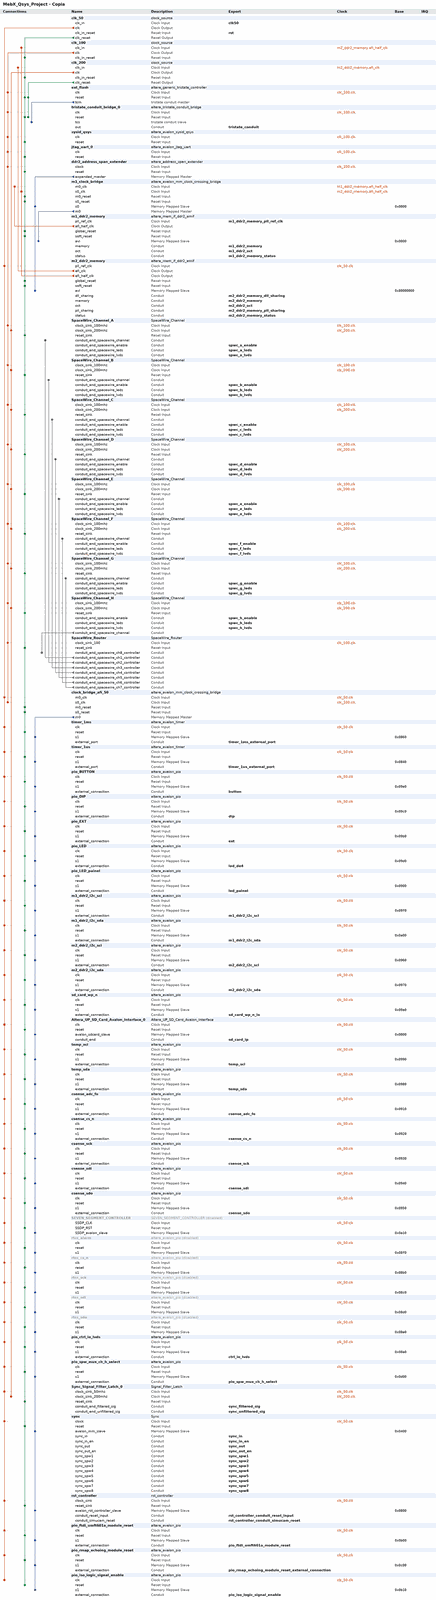
[diagram p0: system contents, whole]
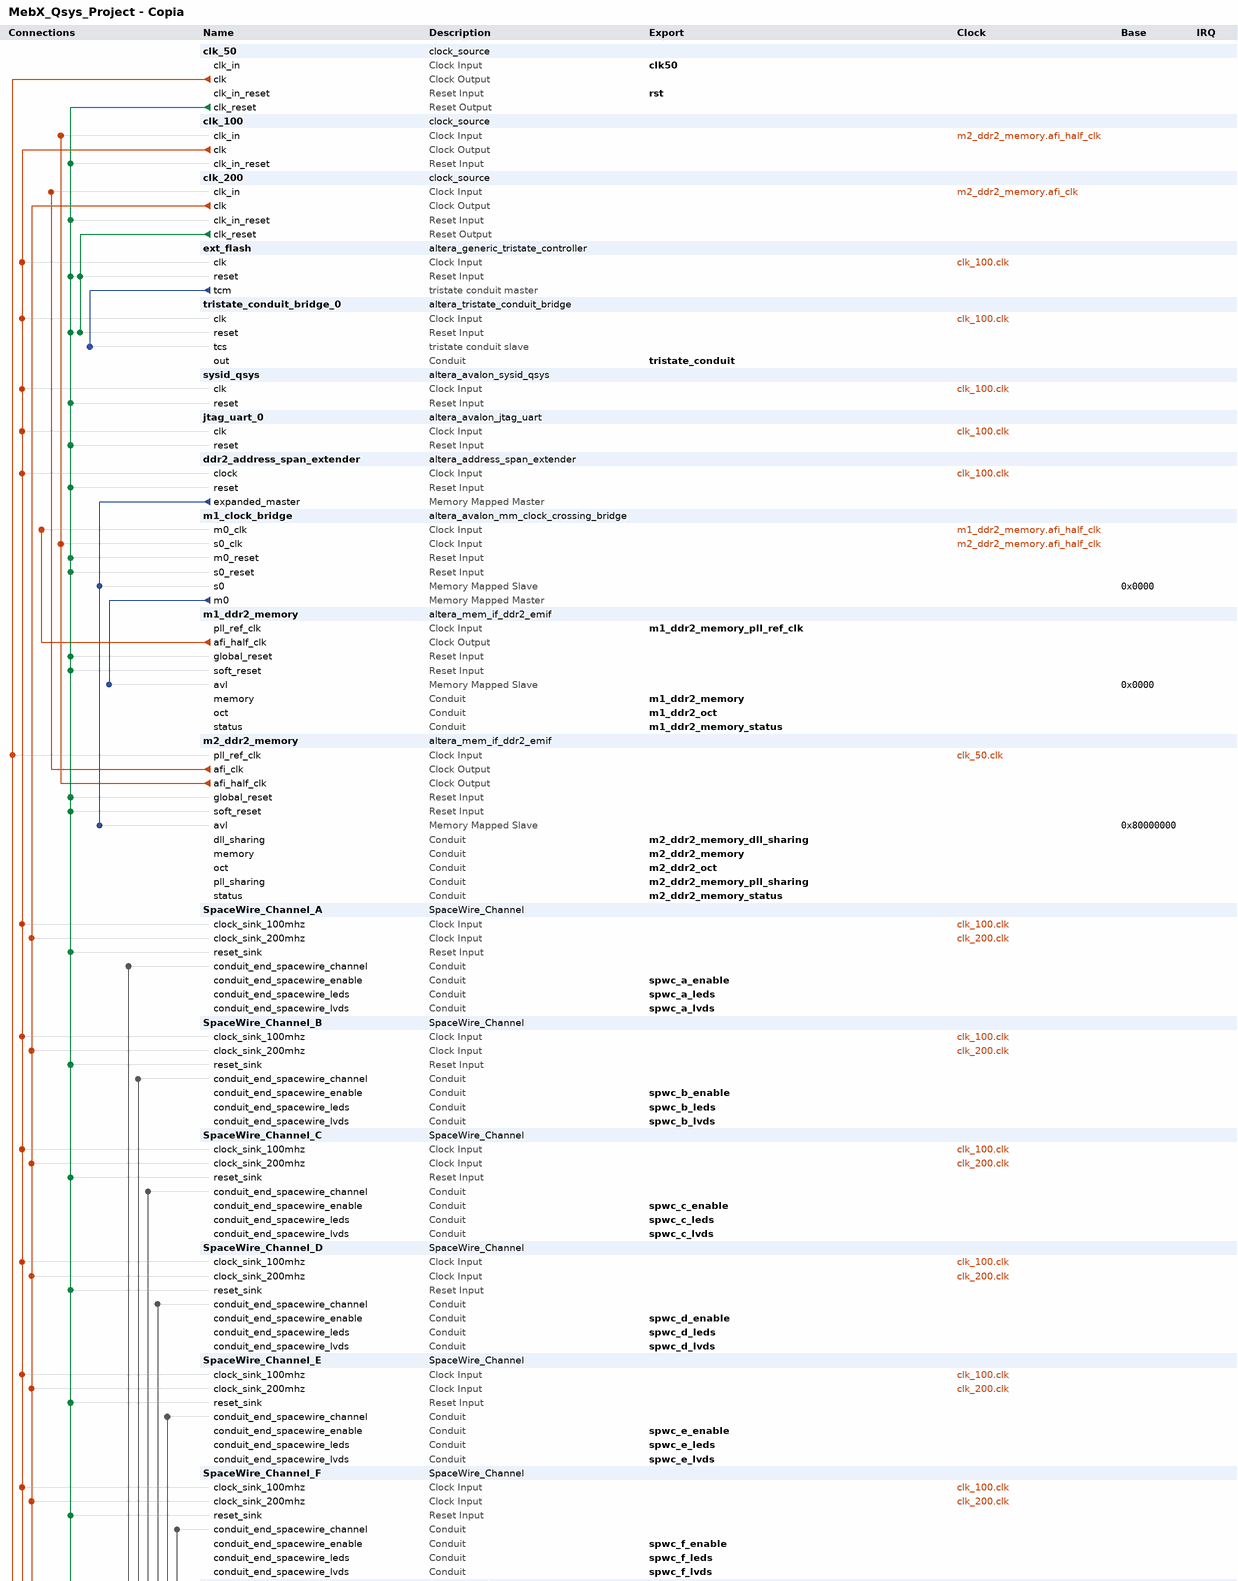
[diagram p1: system contents, upper part]
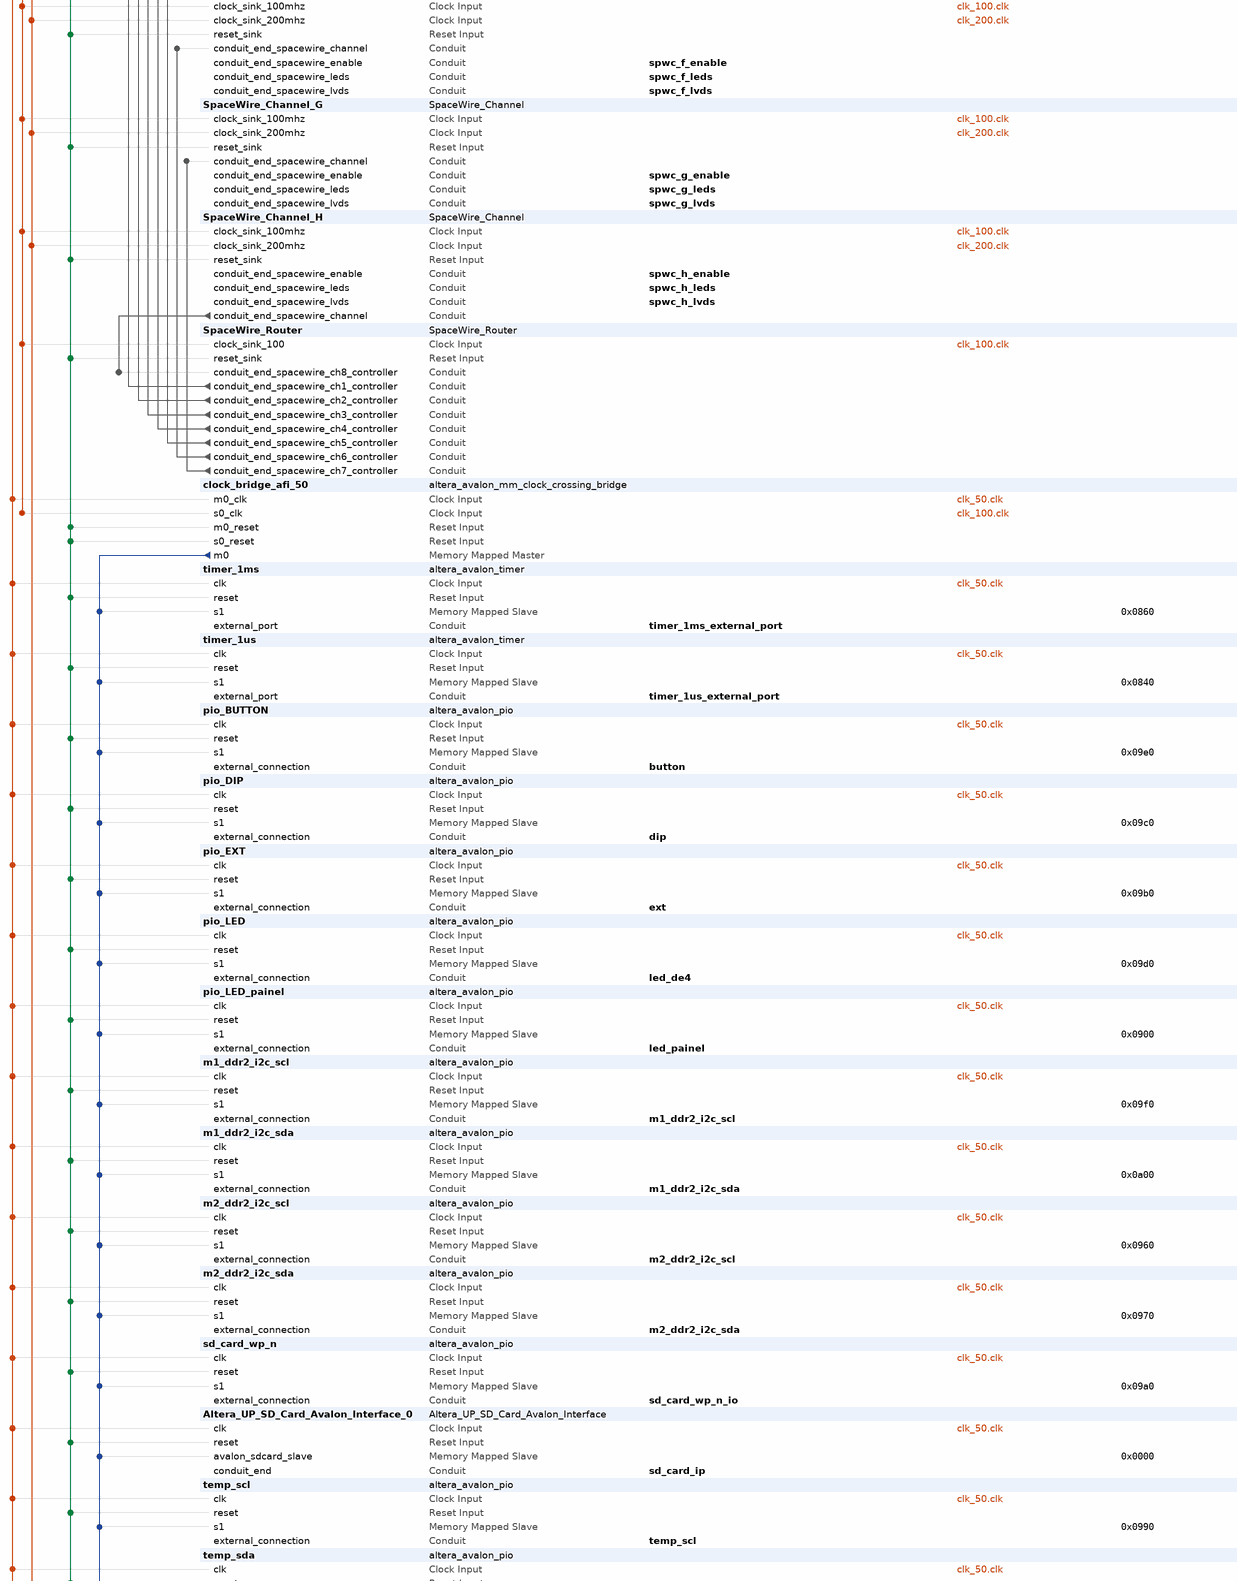
[diagram p2: system contents, middle part]
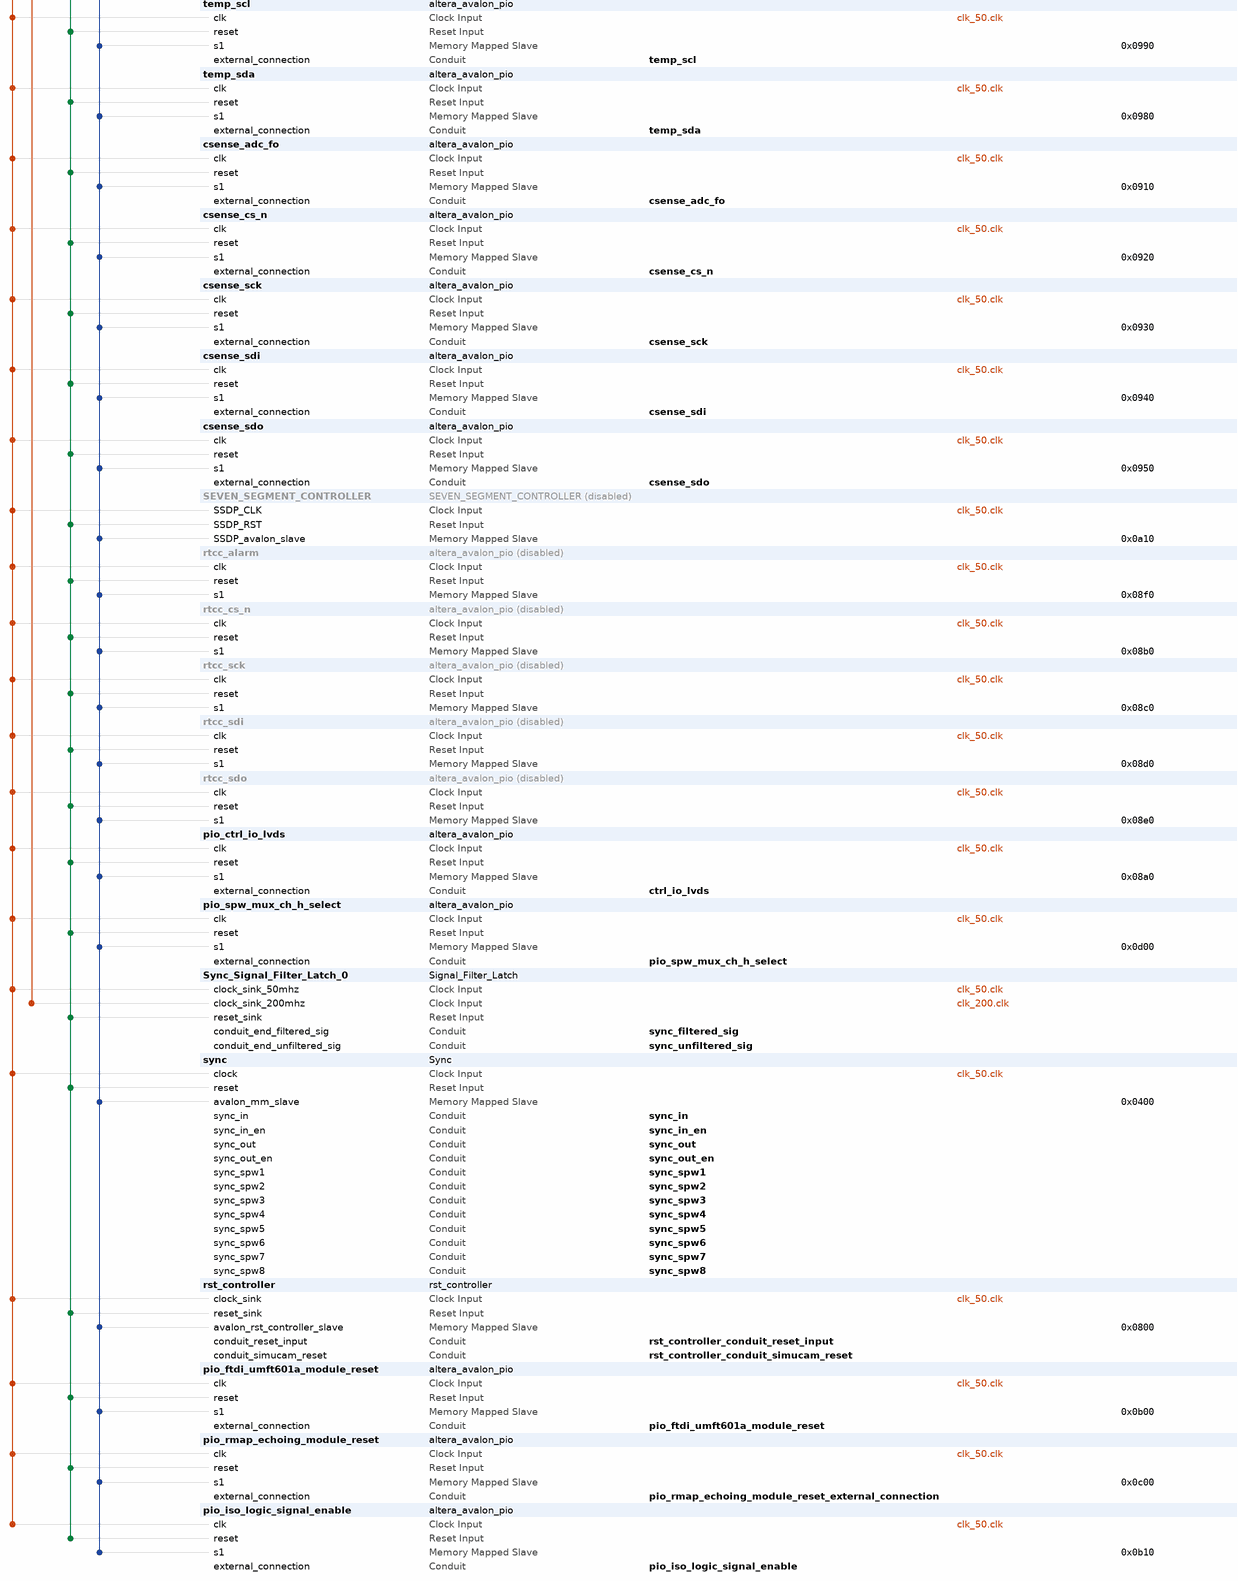
[diagram p3: system contents, lower part]
# Platform Designer (Qsys) system MebX_Qsys_Project - Copia, Stratix IV EP4SGX230KF40C2
# Parameters at their usual value, and those the tool derives, are not listed.
package require -exact qsys 18.1
create_system {MebX_Qsys_Project - Copia}
set_project_property DEVICE_FAMILY {Stratix IV}
set_project_property DEVICE EP4SGX230KF40C2

add_instance clk_50 clock_source 18.1
set_instance_parameter_value clk_50 clockFrequency 50000000

add_instance clk_100 clock_source 18.1
set_instance_parameter_value clk_100 clockFrequency 100000000

add_instance clk_200 clock_source 18.1
set_instance_parameter_value clk_200 clockFrequency 200000000

add_instance ext_flash altera_generic_tristate_controller 18.1
set_instance_parameter_value ext_flash ACTIVE_LOW_BEGINTRANSFER 0
set_instance_parameter_value ext_flash ACTIVE_LOW_BYTEENABLE 0
set_instance_parameter_value ext_flash ACTIVE_LOW_OUTPUTENABLE 0
set_instance_parameter_value ext_flash ACTIVE_LOW_READ 1
set_instance_parameter_value ext_flash CHIPSELECT_THROUGH_READLATENCY 0
set_instance_parameter_value ext_flash INTERFACE_ASSIGNMENT_KEYS embeddedsw.configuration.isFlash,embeddedsw.configuration.isNonVolatileStorage,embeddedsw.configuration.isMemoryDevice
set_instance_parameter_value ext_flash INTERFACE_ASSIGNMENT_VALUES 1,1,1
set_instance_parameter_value ext_flash MODULE_ASSIGNMENT_KEYS embeddedsw.configuration.hwClassnameDriverSupportList,embeddedsw.configuration.hwClassnameDriverSupportDefault,embeddedsw.CMacro.SETUP_VALUE,embeddedsw.CMacro.WAIT_VALUE,embeddedsw.CMacro.HOLD_VALUE,embeddedsw.CMacro.TIMING_UNITS,embeddedsw.CMacro.SIZE,embeddedsw.memoryInfo.MEM_INIT_DATA_WIDTH,embeddedsw.memoryInfo.HAS_BYTE_LANE,embeddedsw.memoryInfo.IS_FLASH,embeddedsw.memoryInfo.GENERATE_DAT_SYM,embeddedsw.memoryInfo.GENERATE_FLASH,embeddedsw.memoryInfo.DAT_SYM_INSTALL_DIR,embeddedsw.memoryInfo.FLASH_INSTALL_DIR
set_instance_parameter_value ext_flash MODULE_ASSIGNMENT_VALUES "altera_avalon_lan91c111\\,altera_avalon_cfi_flash,altera_avalon_cfi_flash,25,100,20,\"ns\",33554432u,16,1,1,1,1,SIM_DIR,APP_DIR"
set_instance_parameter_value ext_flash TCM_ADDRESS_W 26
set_instance_parameter_value ext_flash TCM_BYTEENABLE_W 2
set_instance_parameter_value ext_flash TCM_DATA_HOLD 20
set_instance_parameter_value ext_flash TCM_DATA_W 16
set_instance_parameter_value ext_flash TCM_MAX_PENDING_READ_TRANSACTIONS 3
set_instance_parameter_value ext_flash TCM_READLATENCY 2
set_instance_parameter_value ext_flash TCM_READ_WAIT 100
set_instance_parameter_value ext_flash TCM_SETUP_WAIT 25
set_instance_parameter_value ext_flash TCM_SYMBOLS_PER_WORD 2
set_instance_parameter_value ext_flash TCM_TIMING_UNITS 0
set_instance_parameter_value ext_flash TCM_TURNAROUND_TIME 2
set_instance_parameter_value ext_flash TCM_WRITE_WAIT 100
set_instance_parameter_value ext_flash USE_BEGINTRANSFER 0
set_instance_parameter_value ext_flash USE_BYTEENABLE 0
set_instance_parameter_value ext_flash USE_OUTPUTENABLE 0
set_instance_parameter_value ext_flash USE_READ 1

add_instance tristate_conduit_bridge_0 altera_tristate_conduit_bridge 18.1

add_instance sysid_qsys altera_avalon_sysid_qsys 18.1
set_instance_parameter_value sysid_qsys id 113

add_instance jtag_uart_0 altera_avalon_jtag_uart 18.1
set_instance_parameter_value jtag_uart_0 simInteractiveOptions NO_INTERACTIVE_WINDOWS

add_instance ddr2_address_span_extender altera_address_span_extender 18.1
set_instance_parameter_value ddr2_address_span_extender BURSTCOUNT_WIDTH 8
set_instance_parameter_value ddr2_address_span_extender DATA_WIDTH 32
set_instance_parameter_value ddr2_address_span_extender ENABLE_SLAVE_PORT true
set_instance_parameter_value ddr2_address_span_extender MASTER_ADDRESS_DEF 0
set_instance_parameter_value ddr2_address_span_extender MAX_PENDING_READS 8
set_instance_parameter_value ddr2_address_span_extender SLAVE_ADDRESS_WIDTH 29

add_instance m1_clock_bridge altera_avalon_mm_clock_crossing_bridge 18.1
set_instance_parameter_value m1_clock_bridge ADDRESS_WIDTH 31
set_instance_parameter_value m1_clock_bridge COMMAND_FIFO_DEPTH 2
set_instance_parameter_value m1_clock_bridge DATA_WIDTH 256
set_instance_parameter_value m1_clock_bridge MASTER_SYNC_DEPTH 2
set_instance_parameter_value m1_clock_bridge MAX_BURST_SIZE 1
set_instance_parameter_value m1_clock_bridge RESPONSE_FIFO_DEPTH 2
set_instance_parameter_value m1_clock_bridge SLAVE_SYNC_DEPTH 2
set_instance_parameter_value m1_clock_bridge USE_AUTO_ADDRESS_WIDTH 1

add_instance m1_ddr2_memory altera_mem_if_ddr2_emif 18.1
set_instance_parameter_value m1_ddr2_memory AVL_MAX_SIZE 1
set_instance_parameter_value m1_ddr2_memory CALIBRATION_MODE Full
set_instance_parameter_value m1_ddr2_memory DLL_SHARING_MODE None
set_instance_parameter_value m1_ddr2_memory EXPORT_AFI_HALF_CLK true
set_instance_parameter_value m1_ddr2_memory MEM_BANKADDR_WIDTH 3
set_instance_parameter_value m1_ddr2_memory MEM_CLK_FREQ 400.0
set_instance_parameter_value m1_ddr2_memory MEM_COL_ADDR_WIDTH 10
set_instance_parameter_value m1_ddr2_memory MEM_DQ_WIDTH 64
set_instance_parameter_value m1_ddr2_memory MEM_NUMBER_OF_RANKS_PER_DIMM 2
set_instance_parameter_value m1_ddr2_memory MEM_ROW_ADDR_WIDTH 14
set_instance_parameter_value m1_ddr2_memory MEM_TCL 6
set_instance_parameter_value m1_ddr2_memory MEM_TRAS_NS 45.0
set_instance_parameter_value m1_ddr2_memory PLL_SHARING_MODE None
set_instance_parameter_value m1_ddr2_memory POWER_OF_TWO_BUS true
set_instance_parameter_value m1_ddr2_memory REF_CLK_FREQ 50.0
set_instance_parameter_value m1_ddr2_memory TIMING_TDQSQ 240
set_instance_parameter_value m1_ddr2_memory TIMING_TIH 375
set_instance_parameter_value m1_ddr2_memory TIMING_TQHS 340
set_instance_parameter_value m1_ddr2_memory USER_DEBUG_LEVEL 0

add_instance m2_ddr2_memory altera_mem_if_ddr2_emif 18.1
set_instance_parameter_value m2_ddr2_memory AVL_MAX_SIZE 1
set_instance_parameter_value m2_ddr2_memory CALIBRATION_MODE Full
set_instance_parameter_value m2_ddr2_memory DLL_SHARING_MODE Master
set_instance_parameter_value m2_ddr2_memory EXPORT_AFI_HALF_CLK true
set_instance_parameter_value m2_ddr2_memory MEM_BANKADDR_WIDTH 3
set_instance_parameter_value m2_ddr2_memory MEM_CLK_FREQ 400.0
set_instance_parameter_value m2_ddr2_memory MEM_COL_ADDR_WIDTH 10
set_instance_parameter_value m2_ddr2_memory MEM_DQ_WIDTH 64
set_instance_parameter_value m2_ddr2_memory MEM_NUMBER_OF_RANKS_PER_DIMM 2
set_instance_parameter_value m2_ddr2_memory MEM_ROW_ADDR_WIDTH 14
set_instance_parameter_value m2_ddr2_memory MEM_TCL 6
set_instance_parameter_value m2_ddr2_memory MEM_TRAS_NS 45.0
set_instance_parameter_value m2_ddr2_memory PLL_SHARING_MODE Master
set_instance_parameter_value m2_ddr2_memory POWER_OF_TWO_BUS true
set_instance_parameter_value m2_ddr2_memory REF_CLK_FREQ 50.0
set_instance_parameter_value m2_ddr2_memory TIMING_TDQSQ 240
set_instance_parameter_value m2_ddr2_memory TIMING_TIH 375
set_instance_parameter_value m2_ddr2_memory TIMING_TQHS 340
set_instance_parameter_value m2_ddr2_memory USER_DEBUG_LEVEL 0

add_instance SpaceWire_Channel_A SpaceWire_Channel 1.5

add_instance SpaceWire_Channel_B SpaceWire_Channel 1.5

add_instance SpaceWire_Channel_C SpaceWire_Channel 1.5

add_instance SpaceWire_Channel_D SpaceWire_Channel 1.5

add_instance SpaceWire_Channel_E SpaceWire_Channel 1.5

add_instance SpaceWire_Channel_F SpaceWire_Channel 1.5

add_instance SpaceWire_Channel_G SpaceWire_Channel 1.5

add_instance SpaceWire_Channel_H SpaceWire_Channel 1.5

add_instance SpaceWire_Router SpaceWire_Router 1.0

add_instance clock_bridge_afi_50 altera_avalon_mm_clock_crossing_bridge 18.1
set_instance_parameter_value clock_bridge_afi_50 ADDRESS_WIDTH 32
set_instance_parameter_value clock_bridge_afi_50 COMMAND_FIFO_DEPTH 4
set_instance_parameter_value clock_bridge_afi_50 DATA_WIDTH 32
set_instance_parameter_value clock_bridge_afi_50 MASTER_SYNC_DEPTH 2
set_instance_parameter_value clock_bridge_afi_50 MAX_BURST_SIZE 1
set_instance_parameter_value clock_bridge_afi_50 RESPONSE_FIFO_DEPTH 4
set_instance_parameter_value clock_bridge_afi_50 SLAVE_SYNC_DEPTH 2
set_instance_parameter_value clock_bridge_afi_50 USE_AUTO_ADDRESS_WIDTH 1

add_instance timer_1ms altera_avalon_timer 18.1
set_instance_parameter_value timer_1ms alwaysRun true
set_instance_parameter_value timer_1ms period 1
set_instance_parameter_value timer_1ms periodUnits MSEC
set_instance_parameter_value timer_1ms timeoutPulseOutput true

add_instance timer_1us altera_avalon_timer 18.1
set_instance_parameter_value timer_1us alwaysRun true
set_instance_parameter_value timer_1us period 1
set_instance_parameter_value timer_1us periodUnits USEC
set_instance_parameter_value timer_1us timeoutPulseOutput true

add_instance pio_BUTTON altera_avalon_pio 18.1
set_instance_parameter_value pio_BUTTON direction Input
set_instance_parameter_value pio_BUTTON width 4

add_instance pio_DIP altera_avalon_pio 18.1
set_instance_parameter_value pio_DIP direction Input
set_instance_parameter_value pio_DIP width 8

add_instance pio_EXT altera_avalon_pio 18.1
set_instance_parameter_value pio_EXT bitClearingEdgeCapReg true
set_instance_parameter_value pio_EXT direction Input
set_instance_parameter_value pio_EXT width 1

add_instance pio_LED altera_avalon_pio 18.1
set_instance_parameter_value pio_LED direction Output
set_instance_parameter_value pio_LED width 8

add_instance pio_LED_painel altera_avalon_pio 18.1
set_instance_parameter_value pio_LED_painel direction Output
set_instance_parameter_value pio_LED_painel resetValue 65536
set_instance_parameter_value pio_LED_painel width 21

add_instance m1_ddr2_i2c_scl altera_avalon_pio 18.1
set_instance_parameter_value m1_ddr2_i2c_scl direction Output
set_instance_parameter_value m1_ddr2_i2c_scl width 1

add_instance m1_ddr2_i2c_sda altera_avalon_pio 18.1
set_instance_parameter_value m1_ddr2_i2c_sda direction Bidir
set_instance_parameter_value m1_ddr2_i2c_sda width 1

add_instance m2_ddr2_i2c_scl altera_avalon_pio 18.1
set_instance_parameter_value m2_ddr2_i2c_scl direction Output
set_instance_parameter_value m2_ddr2_i2c_scl width 1

add_instance m2_ddr2_i2c_sda altera_avalon_pio 18.1
set_instance_parameter_value m2_ddr2_i2c_sda direction Bidir
set_instance_parameter_value m2_ddr2_i2c_sda width 1

add_instance sd_card_wp_n altera_avalon_pio 18.1
set_instance_parameter_value sd_card_wp_n direction Input
set_instance_parameter_value sd_card_wp_n width 1

add_instance Altera_UP_SD_Card_Avalon_Interface_0 Altera_UP_SD_Card_Avalon_Interface 18.0

add_instance temp_scl altera_avalon_pio 18.1
set_instance_parameter_value temp_scl direction Output
set_instance_parameter_value temp_scl width 1

add_instance temp_sda altera_avalon_pio 18.1
set_instance_parameter_value temp_sda direction Bidir
set_instance_parameter_value temp_sda width 1

add_instance csense_adc_fo altera_avalon_pio 18.1
set_instance_parameter_value csense_adc_fo direction Output
set_instance_parameter_value csense_adc_fo width 1

add_instance csense_cs_n altera_avalon_pio 18.1
set_instance_parameter_value csense_cs_n direction Output
set_instance_parameter_value csense_cs_n width 2

add_instance csense_sck altera_avalon_pio 18.1
set_instance_parameter_value csense_sck direction Output
set_instance_parameter_value csense_sck width 1

add_instance csense_sdi altera_avalon_pio 18.1
set_instance_parameter_value csense_sdi direction Output
set_instance_parameter_value csense_sdi width 1

add_instance csense_sdo altera_avalon_pio 18.1
set_instance_parameter_value csense_sdo direction Input
set_instance_parameter_value csense_sdo width 1

add_instance SEVEN_SEGMENT_CONTROLLER SEVEN_SEGMENT_CONTROLLER 1.0
set_instance_property SEVEN_SEGMENT_CONTROLLER ENABLED false

add_instance rtcc_alarm altera_avalon_pio 18.1
set_instance_property rtcc_alarm ENABLED false
set_instance_parameter_value rtcc_alarm direction Input
set_instance_parameter_value rtcc_alarm width 1

add_instance rtcc_cs_n altera_avalon_pio 18.1
set_instance_property rtcc_cs_n ENABLED false
set_instance_parameter_value rtcc_cs_n direction Output
set_instance_parameter_value rtcc_cs_n width 1

add_instance rtcc_sck altera_avalon_pio 18.1
set_instance_property rtcc_sck ENABLED false
set_instance_parameter_value rtcc_sck direction Output
set_instance_parameter_value rtcc_sck width 1

add_instance rtcc_sdi altera_avalon_pio 18.1
set_instance_property rtcc_sdi ENABLED false
set_instance_parameter_value rtcc_sdi direction Output
set_instance_parameter_value rtcc_sdi width 1

add_instance rtcc_sdo altera_avalon_pio 18.1
set_instance_property rtcc_sdo ENABLED false
set_instance_parameter_value rtcc_sdo direction Input
set_instance_parameter_value rtcc_sdo width 1

add_instance pio_ctrl_io_lvds altera_avalon_pio 18.1
set_instance_parameter_value pio_ctrl_io_lvds direction Output
set_instance_parameter_value pio_ctrl_io_lvds resetValue 4
set_instance_parameter_value pio_ctrl_io_lvds width 4

add_instance pio_spw_mux_ch_h_select altera_avalon_pio 18.1
set_instance_parameter_value pio_spw_mux_ch_h_select direction Output
set_instance_parameter_value pio_spw_mux_ch_h_select resetValue 3
set_instance_parameter_value pio_spw_mux_ch_h_select width 2

add_instance Sync_Signal_Filter_Latch_0 Signal_Filter_Latch 1.0

add_instance sync Sync 1.8
set_instance_parameter_value sync g_PRE_SYNC_IRQ_NUMBER 12
set_instance_parameter_value sync g_SYNC_IRQ_NUMBER 11

add_instance rst_controller rst_controller 1.6

add_instance pio_ftdi_umft601a_module_reset altera_avalon_pio 18.1
set_instance_parameter_value pio_ftdi_umft601a_module_reset direction Output
set_instance_parameter_value pio_ftdi_umft601a_module_reset width 1

add_instance pio_rmap_echoing_module_reset altera_avalon_pio 18.1
set_instance_parameter_value pio_rmap_echoing_module_reset direction Output
set_instance_parameter_value pio_rmap_echoing_module_reset width 1

add_instance pio_iso_logic_signal_enable altera_avalon_pio 18.1
set_instance_parameter_value pio_iso_logic_signal_enable direction Output
set_instance_parameter_value pio_iso_logic_signal_enable width 1

# connections
add_connection clk_50.clk Altera_UP_SD_Card_Avalon_Interface_0.clk clock
add_connection clk_50.clk clock_bridge_afi_50.m0_clk clock
add_connection clk_50.clk csense_adc_fo.clk clock
add_connection clk_50.clk csense_cs_n.clk clock
add_connection clk_50.clk csense_sck.clk clock
add_connection clk_50.clk csense_sdi.clk clock
add_connection clk_50.clk csense_sdo.clk clock
add_connection clk_50.clk m1_ddr2_i2c_scl.clk clock
add_connection clk_50.clk m1_ddr2_i2c_sda.clk clock
add_connection clk_50.clk m2_ddr2_i2c_scl.clk clock
add_connection clk_50.clk m2_ddr2_i2c_sda.clk clock
add_connection clk_50.clk m2_ddr2_memory.pll_ref_clk clock
add_connection clk_50.clk pio_BUTTON.clk clock
add_connection clk_50.clk pio_ctrl_io_lvds.clk clock
add_connection clk_50.clk pio_DIP.clk clock
add_connection clk_50.clk pio_EXT.clk clock
add_connection clk_50.clk pio_ftdi_umft601a_module_reset.clk clock
add_connection clk_50.clk pio_iso_logic_signal_enable.clk clock
add_connection clk_50.clk pio_LED.clk clock
add_connection clk_50.clk pio_LED_painel.clk clock
add_connection clk_50.clk pio_rmap_echoing_module_reset.clk clock
add_connection clk_50.clk pio_spw_mux_ch_h_select.clk clock
add_connection clk_50.clk rst_controller.clock_sink clock
add_connection clk_50.clk rtcc_alarm.clk clock
add_connection clk_50.clk rtcc_cs_n.clk clock
add_connection clk_50.clk rtcc_sck.clk clock
add_connection clk_50.clk rtcc_sdi.clk clock
add_connection clk_50.clk rtcc_sdo.clk clock
add_connection clk_50.clk sd_card_wp_n.clk clock
add_connection clk_50.clk SEVEN_SEGMENT_CONTROLLER.SSDP_CLK clock
add_connection clk_50.clk sync.clock clock
add_connection clk_50.clk Sync_Signal_Filter_Latch_0.clock_sink_50mhz clock
add_connection clk_50.clk temp_scl.clk clock
add_connection clk_50.clk temp_sda.clk clock
add_connection clk_50.clk timer_1ms.clk clock
add_connection clk_50.clk timer_1us.clk clock
add_connection clk_100.clk clock_bridge_afi_50.s0_clk clock
add_connection clk_100.clk ddr2_address_span_extender.clock clock
add_connection clk_100.clk ext_flash.clk clock
add_connection clk_100.clk jtag_uart_0.clk clock
add_connection clk_100.clk SpaceWire_Channel_A.clock_sink_100mhz clock
add_connection clk_100.clk SpaceWire_Channel_B.clock_sink_100mhz clock
add_connection clk_100.clk SpaceWire_Channel_C.clock_sink_100mhz clock
add_connection clk_100.clk SpaceWire_Channel_D.clock_sink_100mhz clock
add_connection clk_100.clk SpaceWire_Channel_E.clock_sink_100mhz clock
add_connection clk_100.clk SpaceWire_Channel_F.clock_sink_100mhz clock
add_connection clk_100.clk SpaceWire_Channel_G.clock_sink_100mhz clock
add_connection clk_100.clk SpaceWire_Channel_H.clock_sink_100mhz clock
add_connection clk_100.clk SpaceWire_Router.clock_sink_100 clock
add_connection clk_100.clk sysid_qsys.clk clock
add_connection clk_100.clk tristate_conduit_bridge_0.clk clock
add_connection clk_200.clk SpaceWire_Channel_A.clock_sink_200mhz clock
add_connection clk_200.clk SpaceWire_Channel_B.clock_sink_200mhz clock
add_connection clk_200.clk SpaceWire_Channel_C.clock_sink_200mhz clock
add_connection clk_200.clk SpaceWire_Channel_D.clock_sink_200mhz clock
add_connection clk_200.clk SpaceWire_Channel_E.clock_sink_200mhz clock
add_connection clk_200.clk SpaceWire_Channel_F.clock_sink_200mhz clock
add_connection clk_200.clk SpaceWire_Channel_G.clock_sink_200mhz clock
add_connection clk_200.clk SpaceWire_Channel_H.clock_sink_200mhz clock
add_connection clk_200.clk Sync_Signal_Filter_Latch_0.clock_sink_200mhz clock
add_connection m1_ddr2_memory.afi_half_clk m1_clock_bridge.m0_clk clock
add_connection m2_ddr2_memory.afi_clk clk_200.clk_in clock
add_connection m2_ddr2_memory.afi_half_clk clk_100.clk_in clock
add_connection m2_ddr2_memory.afi_half_clk m1_clock_bridge.s0_clk clock
add_connection clk_50.clk_reset Altera_UP_SD_Card_Avalon_Interface_0.reset reset
add_connection clk_50.clk_reset clk_100.clk_in_reset reset
add_connection clk_50.clk_reset clk_200.clk_in_reset reset
add_connection clk_50.clk_reset clock_bridge_afi_50.m0_reset reset
add_connection clk_50.clk_reset clock_bridge_afi_50.s0_reset reset
add_connection clk_50.clk_reset csense_adc_fo.reset reset
add_connection clk_50.clk_reset csense_cs_n.reset reset
add_connection clk_50.clk_reset csense_sck.reset reset
add_connection clk_50.clk_reset csense_sdi.reset reset
add_connection clk_50.clk_reset csense_sdo.reset reset
add_connection clk_50.clk_reset ddr2_address_span_extender.reset reset
add_connection clk_50.clk_reset ext_flash.reset reset
add_connection clk_50.clk_reset jtag_uart_0.reset reset
add_connection clk_50.clk_reset m1_clock_bridge.m0_reset reset
add_connection clk_50.clk_reset m1_clock_bridge.s0_reset reset
add_connection clk_50.clk_reset m1_ddr2_i2c_scl.reset reset
add_connection clk_50.clk_reset m1_ddr2_i2c_sda.reset reset
add_connection clk_50.clk_reset m1_ddr2_memory.global_reset reset
add_connection clk_50.clk_reset m1_ddr2_memory.soft_reset reset
add_connection clk_50.clk_reset m2_ddr2_i2c_scl.reset reset
add_connection clk_50.clk_reset m2_ddr2_i2c_sda.reset reset
add_connection clk_50.clk_reset m2_ddr2_memory.global_reset reset
add_connection clk_50.clk_reset m2_ddr2_memory.soft_reset reset
add_connection clk_50.clk_reset pio_BUTTON.reset reset
add_connection clk_50.clk_reset pio_ctrl_io_lvds.reset reset
add_connection clk_50.clk_reset pio_DIP.reset reset
add_connection clk_50.clk_reset pio_EXT.reset reset
add_connection clk_50.clk_reset pio_ftdi_umft601a_module_reset.reset reset
add_connection clk_50.clk_reset pio_iso_logic_signal_enable.reset reset
add_connection clk_50.clk_reset pio_LED.reset reset
add_connection clk_50.clk_reset pio_LED_painel.reset reset
add_connection clk_50.clk_reset pio_rmap_echoing_module_reset.reset reset
add_connection clk_50.clk_reset pio_spw_mux_ch_h_select.reset reset
add_connection clk_50.clk_reset rst_controller.reset_sink reset
add_connection clk_50.clk_reset rtcc_alarm.reset reset
add_connection clk_50.clk_reset rtcc_cs_n.reset reset
add_connection clk_50.clk_reset rtcc_sck.reset reset
add_connection clk_50.clk_reset rtcc_sdi.reset reset
add_connection clk_50.clk_reset rtcc_sdo.reset reset
add_connection clk_50.clk_reset sd_card_wp_n.reset reset
add_connection clk_50.clk_reset SEVEN_SEGMENT_CONTROLLER.SSDP_RST reset
add_connection clk_50.clk_reset SpaceWire_Channel_A.reset_sink reset
add_connection clk_50.clk_reset SpaceWire_Channel_B.reset_sink reset
add_connection clk_50.clk_reset SpaceWire_Channel_C.reset_sink reset
add_connection clk_50.clk_reset SpaceWire_Channel_D.reset_sink reset
add_connection clk_50.clk_reset SpaceWire_Channel_E.reset_sink reset
add_connection clk_50.clk_reset SpaceWire_Channel_F.reset_sink reset
add_connection clk_50.clk_reset SpaceWire_Channel_G.reset_sink reset
add_connection clk_50.clk_reset SpaceWire_Channel_H.reset_sink reset
add_connection clk_50.clk_reset SpaceWire_Router.reset_sink reset
add_connection clk_50.clk_reset sync.reset reset
add_connection clk_50.clk_reset Sync_Signal_Filter_Latch_0.reset_sink reset
add_connection clk_50.clk_reset sysid_qsys.reset reset
add_connection clk_50.clk_reset temp_scl.reset reset
add_connection clk_50.clk_reset temp_sda.reset reset
add_connection clk_50.clk_reset timer_1ms.reset reset
add_connection clk_50.clk_reset timer_1us.reset reset
add_connection clk_50.clk_reset tristate_conduit_bridge_0.reset reset
add_connection clk_200.clk_reset ext_flash.reset reset
add_connection clk_200.clk_reset tristate_conduit_bridge_0.reset reset
add_connection clock_bridge_afi_50.m0 Altera_UP_SD_Card_Avalon_Interface_0.avalon_sdcard_slave avalon
set_connection_parameter_value clock_bridge_afi_50.m0/Altera_UP_SD_Card_Avalon_Interface_0.avalon_sdcard_slave baseAddress 0x0000
add_connection clock_bridge_afi_50.m0 csense_adc_fo.s1 avalon
set_connection_parameter_value clock_bridge_afi_50.m0/csense_adc_fo.s1 baseAddress 0x0910
add_connection clock_bridge_afi_50.m0 csense_cs_n.s1 avalon
set_connection_parameter_value clock_bridge_afi_50.m0/csense_cs_n.s1 baseAddress 0x0920
add_connection clock_bridge_afi_50.m0 csense_sck.s1 avalon
set_connection_parameter_value clock_bridge_afi_50.m0/csense_sck.s1 baseAddress 0x0930
add_connection clock_bridge_afi_50.m0 csense_sdi.s1 avalon
set_connection_parameter_value clock_bridge_afi_50.m0/csense_sdi.s1 baseAddress 0x0940
add_connection clock_bridge_afi_50.m0 csense_sdo.s1 avalon
set_connection_parameter_value clock_bridge_afi_50.m0/csense_sdo.s1 baseAddress 0x0950
add_connection clock_bridge_afi_50.m0 m1_ddr2_i2c_scl.s1 avalon
set_connection_parameter_value clock_bridge_afi_50.m0/m1_ddr2_i2c_scl.s1 baseAddress 0x09f0
add_connection clock_bridge_afi_50.m0 m1_ddr2_i2c_sda.s1 avalon
set_connection_parameter_value clock_bridge_afi_50.m0/m1_ddr2_i2c_sda.s1 baseAddress 0x0a00
add_connection clock_bridge_afi_50.m0 m2_ddr2_i2c_scl.s1 avalon
set_connection_parameter_value clock_bridge_afi_50.m0/m2_ddr2_i2c_scl.s1 baseAddress 0x0960
add_connection clock_bridge_afi_50.m0 m2_ddr2_i2c_sda.s1 avalon
set_connection_parameter_value clock_bridge_afi_50.m0/m2_ddr2_i2c_sda.s1 baseAddress 0x0970
add_connection clock_bridge_afi_50.m0 pio_BUTTON.s1 avalon
set_connection_parameter_value clock_bridge_afi_50.m0/pio_BUTTON.s1 baseAddress 0x09e0
add_connection clock_bridge_afi_50.m0 pio_ctrl_io_lvds.s1 avalon
set_connection_parameter_value clock_bridge_afi_50.m0/pio_ctrl_io_lvds.s1 baseAddress 0x08a0
add_connection clock_bridge_afi_50.m0 pio_DIP.s1 avalon
set_connection_parameter_value clock_bridge_afi_50.m0/pio_DIP.s1 baseAddress 0x09c0
add_connection clock_bridge_afi_50.m0 pio_EXT.s1 avalon
set_connection_parameter_value clock_bridge_afi_50.m0/pio_EXT.s1 baseAddress 0x09b0
add_connection clock_bridge_afi_50.m0 pio_ftdi_umft601a_module_reset.s1 avalon
set_connection_parameter_value clock_bridge_afi_50.m0/pio_ftdi_umft601a_module_reset.s1 baseAddress 0x0b00
add_connection clock_bridge_afi_50.m0 pio_iso_logic_signal_enable.s1 avalon
set_connection_parameter_value clock_bridge_afi_50.m0/pio_iso_logic_signal_enable.s1 baseAddress 0x0b10
add_connection clock_bridge_afi_50.m0 pio_LED.s1 avalon
set_connection_parameter_value clock_bridge_afi_50.m0/pio_LED.s1 baseAddress 0x09d0
add_connection clock_bridge_afi_50.m0 pio_LED_painel.s1 avalon
set_connection_parameter_value clock_bridge_afi_50.m0/pio_LED_painel.s1 baseAddress 0x0900
add_connection clock_bridge_afi_50.m0 pio_rmap_echoing_module_reset.s1 avalon
set_connection_parameter_value clock_bridge_afi_50.m0/pio_rmap_echoing_module_reset.s1 baseAddress 0x0c00
add_connection clock_bridge_afi_50.m0 pio_spw_mux_ch_h_select.s1 avalon
set_connection_parameter_value clock_bridge_afi_50.m0/pio_spw_mux_ch_h_select.s1 baseAddress 0x0d00
add_connection clock_bridge_afi_50.m0 rst_controller.avalon_rst_controller_slave avalon
set_connection_parameter_value clock_bridge_afi_50.m0/rst_controller.avalon_rst_controller_slave baseAddress 0x0800
add_connection clock_bridge_afi_50.m0 rtcc_alarm.s1 avalon
set_connection_parameter_value clock_bridge_afi_50.m0/rtcc_alarm.s1 baseAddress 0x08f0
add_connection clock_bridge_afi_50.m0 rtcc_cs_n.s1 avalon
set_connection_parameter_value clock_bridge_afi_50.m0/rtcc_cs_n.s1 baseAddress 0x08b0
add_connection clock_bridge_afi_50.m0 rtcc_sck.s1 avalon
set_connection_parameter_value clock_bridge_afi_50.m0/rtcc_sck.s1 baseAddress 0x08c0
add_connection clock_bridge_afi_50.m0 rtcc_sdi.s1 avalon
set_connection_parameter_value clock_bridge_afi_50.m0/rtcc_sdi.s1 baseAddress 0x08d0
add_connection clock_bridge_afi_50.m0 rtcc_sdo.s1 avalon
set_connection_parameter_value clock_bridge_afi_50.m0/rtcc_sdo.s1 baseAddress 0x08e0
add_connection clock_bridge_afi_50.m0 sd_card_wp_n.s1 avalon
set_connection_parameter_value clock_bridge_afi_50.m0/sd_card_wp_n.s1 baseAddress 0x09a0
add_connection clock_bridge_afi_50.m0 SEVEN_SEGMENT_CONTROLLER.SSDP_avalon_slave avalon
set_connection_parameter_value clock_bridge_afi_50.m0/SEVEN_SEGMENT_CONTROLLER.SSDP_avalon_slave baseAddress 0x0a10
add_connection clock_bridge_afi_50.m0 sync.avalon_mm_slave avalon
set_connection_parameter_value clock_bridge_afi_50.m0/sync.avalon_mm_slave baseAddress 0x0400
add_connection clock_bridge_afi_50.m0 temp_scl.s1 avalon
set_connection_parameter_value clock_bridge_afi_50.m0/temp_scl.s1 baseAddress 0x0990
add_connection clock_bridge_afi_50.m0 temp_sda.s1 avalon
set_connection_parameter_value clock_bridge_afi_50.m0/temp_sda.s1 baseAddress 0x0980
add_connection clock_bridge_afi_50.m0 timer_1ms.s1 avalon
set_connection_parameter_value clock_bridge_afi_50.m0/timer_1ms.s1 baseAddress 0x0860
add_connection clock_bridge_afi_50.m0 timer_1us.s1 avalon
set_connection_parameter_value clock_bridge_afi_50.m0/timer_1us.s1 baseAddress 0x0840
add_connection ddr2_address_span_extender.expanded_master m1_clock_bridge.s0 avalon
set_connection_parameter_value ddr2_address_span_extender.expanded_master/m1_clock_bridge.s0 baseAddress 0x0000
add_connection ddr2_address_span_extender.expanded_master m2_ddr2_memory.avl avalon
set_connection_parameter_value ddr2_address_span_extender.expanded_master/m2_ddr2_memory.avl baseAddress 0x80000000
add_connection m1_clock_bridge.m0 m1_ddr2_memory.avl avalon
set_connection_parameter_value m1_clock_bridge.m0/m1_ddr2_memory.avl baseAddress 0x0000
add_connection SpaceWire_Channel_H.conduit_end_spacewire_channel SpaceWire_Router.conduit_end_spacewire_ch8_controller conduit
add_connection SpaceWire_Router.conduit_end_spacewire_ch1_controller SpaceWire_Channel_A.conduit_end_spacewire_channel conduit
add_connection SpaceWire_Router.conduit_end_spacewire_ch2_controller SpaceWire_Channel_B.conduit_end_spacewire_channel conduit
add_connection SpaceWire_Router.conduit_end_spacewire_ch3_controller SpaceWire_Channel_C.conduit_end_spacewire_channel conduit
add_connection SpaceWire_Router.conduit_end_spacewire_ch4_controller SpaceWire_Channel_D.conduit_end_spacewire_channel conduit
add_connection SpaceWire_Router.conduit_end_spacewire_ch5_controller SpaceWire_Channel_E.conduit_end_spacewire_channel conduit
add_connection SpaceWire_Router.conduit_end_spacewire_ch6_controller SpaceWire_Channel_F.conduit_end_spacewire_channel conduit
add_connection SpaceWire_Router.conduit_end_spacewire_ch7_controller SpaceWire_Channel_G.conduit_end_spacewire_channel conduit
add_connection ext_flash.tcm tristate_conduit_bridge_0.tcs tristate_conduit

# exported interfaces
add_interface button conduit end
set_interface_property button EXPORT_OF pio_BUTTON.external_connection
add_interface clk50 clock sink
set_interface_property clk50 EXPORT_OF clk_50.clk_in
add_interface csense_adc_fo conduit end
set_interface_property csense_adc_fo EXPORT_OF csense_adc_fo.external_connection
add_interface csense_cs_n conduit end
set_interface_property csense_cs_n EXPORT_OF csense_cs_n.external_connection
add_interface csense_sck conduit end
set_interface_property csense_sck EXPORT_OF csense_sck.external_connection
add_interface csense_sdi conduit end
set_interface_property csense_sdi EXPORT_OF csense_sdi.external_connection
add_interface csense_sdo conduit end
set_interface_property csense_sdo EXPORT_OF csense_sdo.external_connection
add_interface ctrl_io_lvds conduit end
set_interface_property ctrl_io_lvds EXPORT_OF pio_ctrl_io_lvds.external_connection
add_interface dip conduit end
set_interface_property dip EXPORT_OF pio_DIP.external_connection
add_interface ext conduit end
set_interface_property ext EXPORT_OF pio_EXT.external_connection
add_interface led_de4 conduit end
set_interface_property led_de4 EXPORT_OF pio_LED.external_connection
add_interface led_painel conduit end
set_interface_property led_painel EXPORT_OF pio_LED_painel.external_connection
add_interface m1_ddr2_i2c_scl conduit end
set_interface_property m1_ddr2_i2c_scl EXPORT_OF m1_ddr2_i2c_scl.external_connection
add_interface m1_ddr2_i2c_sda conduit end
set_interface_property m1_ddr2_i2c_sda EXPORT_OF m1_ddr2_i2c_sda.external_connection
add_interface m1_ddr2_memory conduit end
set_interface_property m1_ddr2_memory EXPORT_OF m1_ddr2_memory.memory
add_interface m1_ddr2_memory_pll_ref_clk clock sink
set_interface_property m1_ddr2_memory_pll_ref_clk EXPORT_OF m1_ddr2_memory.pll_ref_clk
add_interface m1_ddr2_memory_status conduit end
set_interface_property m1_ddr2_memory_status EXPORT_OF m1_ddr2_memory.status
add_interface m1_ddr2_oct conduit end
set_interface_property m1_ddr2_oct EXPORT_OF m1_ddr2_memory.oct
add_interface m2_ddr2_i2c_scl conduit end
set_interface_property m2_ddr2_i2c_scl EXPORT_OF m2_ddr2_i2c_scl.external_connection
add_interface m2_ddr2_i2c_sda conduit end
set_interface_property m2_ddr2_i2c_sda EXPORT_OF m2_ddr2_i2c_sda.external_connection
add_interface m2_ddr2_memory conduit end
set_interface_property m2_ddr2_memory EXPORT_OF m2_ddr2_memory.memory
add_interface m2_ddr2_memory_dll_sharing conduit end
set_interface_property m2_ddr2_memory_dll_sharing EXPORT_OF m2_ddr2_memory.dll_sharing
add_interface m2_ddr2_memory_pll_sharing conduit end
set_interface_property m2_ddr2_memory_pll_sharing EXPORT_OF m2_ddr2_memory.pll_sharing
add_interface m2_ddr2_memory_status conduit end
set_interface_property m2_ddr2_memory_status EXPORT_OF m2_ddr2_memory.status
add_interface m2_ddr2_oct conduit end
set_interface_property m2_ddr2_oct EXPORT_OF m2_ddr2_memory.oct
add_interface pio_ftdi_umft601a_module_reset conduit end
set_interface_property pio_ftdi_umft601a_module_reset EXPORT_OF pio_ftdi_umft601a_module_reset.external_connection
add_interface pio_iso_logic_signal_enable conduit end
set_interface_property pio_iso_logic_signal_enable EXPORT_OF pio_iso_logic_signal_enable.external_connection
add_interface pio_rmap_echoing_module_reset_external_connection conduit end
set_interface_property pio_rmap_echoing_module_reset_external_connection EXPORT_OF pio_rmap_echoing_module_reset.external_connection
add_interface pio_spw_mux_ch_h_select conduit end
set_interface_property pio_spw_mux_ch_h_select EXPORT_OF pio_spw_mux_ch_h_select.external_connection
add_interface rst reset sink
set_interface_property rst EXPORT_OF clk_50.clk_in_reset
add_interface rst_controller_conduit_reset_input conduit end
set_interface_property rst_controller_conduit_reset_input EXPORT_OF rst_controller.conduit_reset_input
add_interface rst_controller_conduit_simucam_reset conduit end
set_interface_property rst_controller_conduit_simucam_reset EXPORT_OF rst_controller.conduit_simucam_reset
add_interface sd_card_ip conduit end
set_interface_property sd_card_ip EXPORT_OF Altera_UP_SD_Card_Avalon_Interface_0.conduit_end
add_interface sd_card_wp_n_io conduit end
set_interface_property sd_card_wp_n_io EXPORT_OF sd_card_wp_n.external_connection
add_interface spwc_a_enable conduit end
set_interface_property spwc_a_enable EXPORT_OF SpaceWire_Channel_A.conduit_end_spacewire_enable
add_interface spwc_a_leds conduit end
set_interface_property spwc_a_leds EXPORT_OF SpaceWire_Channel_A.conduit_end_spacewire_leds
add_interface spwc_a_lvds conduit end
set_interface_property spwc_a_lvds EXPORT_OF SpaceWire_Channel_A.conduit_end_spacewire_lvds
add_interface spwc_b_enable conduit end
set_interface_property spwc_b_enable EXPORT_OF SpaceWire_Channel_B.conduit_end_spacewire_enable
add_interface spwc_b_leds conduit end
set_interface_property spwc_b_leds EXPORT_OF SpaceWire_Channel_B.conduit_end_spacewire_leds
add_interface spwc_b_lvds conduit end
set_interface_property spwc_b_lvds EXPORT_OF SpaceWire_Channel_B.conduit_end_spacewire_lvds
add_interface spwc_c_enable conduit end
set_interface_property spwc_c_enable EXPORT_OF SpaceWire_Channel_C.conduit_end_spacewire_enable
add_interface spwc_c_leds conduit end
set_interface_property spwc_c_leds EXPORT_OF SpaceWire_Channel_C.conduit_end_spacewire_leds
add_interface spwc_c_lvds conduit end
set_interface_property spwc_c_lvds EXPORT_OF SpaceWire_Channel_C.conduit_end_spacewire_lvds
add_interface spwc_d_enable conduit end
set_interface_property spwc_d_enable EXPORT_OF SpaceWire_Channel_D.conduit_end_spacewire_enable
add_interface spwc_d_leds conduit end
set_interface_property spwc_d_leds EXPORT_OF SpaceWire_Channel_D.conduit_end_spacewire_leds
add_interface spwc_d_lvds conduit end
set_interface_property spwc_d_lvds EXPORT_OF SpaceWire_Channel_D.conduit_end_spacewire_lvds
add_interface spwc_e_enable conduit end
set_interface_property spwc_e_enable EXPORT_OF SpaceWire_Channel_E.conduit_end_spacewire_enable
add_interface spwc_e_leds conduit end
set_interface_property spwc_e_leds EXPORT_OF SpaceWire_Channel_E.conduit_end_spacewire_leds
add_interface spwc_e_lvds conduit end
set_interface_property spwc_e_lvds EXPORT_OF SpaceWire_Channel_E.conduit_end_spacewire_lvds
add_interface spwc_f_enable conduit end
set_interface_property spwc_f_enable EXPORT_OF SpaceWire_Channel_F.conduit_end_spacewire_enable
add_interface spwc_f_leds conduit end
set_interface_property spwc_f_leds EXPORT_OF SpaceWire_Channel_F.conduit_end_spacewire_leds
add_interface spwc_f_lvds conduit end
set_interface_property spwc_f_lvds EXPORT_OF SpaceWire_Channel_F.conduit_end_spacewire_lvds
add_interface spwc_g_enable conduit end
set_interface_property spwc_g_enable EXPORT_OF SpaceWire_Channel_G.conduit_end_spacewire_enable
add_interface spwc_g_leds conduit end
set_interface_property spwc_g_leds EXPORT_OF SpaceWire_Channel_G.conduit_end_spacewire_leds
add_interface spwc_g_lvds conduit end
set_interface_property spwc_g_lvds EXPORT_OF SpaceWire_Channel_G.conduit_end_spacewire_lvds
add_interface spwc_h_enable conduit end
set_interface_property spwc_h_enable EXPORT_OF SpaceWire_Channel_H.conduit_end_spacewire_enable
add_interface spwc_h_leds conduit end
set_interface_property spwc_h_leds EXPORT_OF SpaceWire_Channel_H.conduit_end_spacewire_leds
add_interface spwc_h_lvds conduit end
set_interface_property spwc_h_lvds EXPORT_OF SpaceWire_Channel_H.conduit_end_spacewire_lvds
add_interface sync_filtered_sig conduit end
set_interface_property sync_filtered_sig EXPORT_OF Sync_Signal_Filter_Latch_0.conduit_end_filtered_sig
add_interface sync_in conduit end
set_interface_property sync_in EXPORT_OF sync.sync_in
add_interface sync_in_en conduit end
set_interface_property sync_in_en EXPORT_OF sync.sync_in_en
add_interface sync_out conduit end
set_interface_property sync_out EXPORT_OF sync.sync_out
add_interface sync_out_en conduit end
set_interface_property sync_out_en EXPORT_OF sync.sync_out_en
add_interface sync_spw1 conduit end
set_interface_property sync_spw1 EXPORT_OF sync.sync_spw1
add_interface sync_spw2 conduit end
set_interface_property sync_spw2 EXPORT_OF sync.sync_spw2
add_interface sync_spw3 conduit end
set_interface_property sync_spw3 EXPORT_OF sync.sync_spw3
add_interface sync_spw4 conduit end
set_interface_property sync_spw4 EXPORT_OF sync.sync_spw4
add_interface sync_spw5 conduit end
set_interface_property sync_spw5 EXPORT_OF sync.sync_spw5
add_interface sync_spw6 conduit end
set_interface_property sync_spw6 EXPORT_OF sync.sync_spw6
add_interface sync_spw7 conduit end
set_interface_property sync_spw7 EXPORT_OF sync.sync_spw7
add_interface sync_spw8 conduit end
set_interface_property sync_spw8 EXPORT_OF sync.sync_spw8
add_interface sync_unfiltered_sig conduit end
set_interface_property sync_unfiltered_sig EXPORT_OF Sync_Signal_Filter_Latch_0.conduit_end_unfiltered_sig
add_interface temp_scl conduit end
set_interface_property temp_scl EXPORT_OF temp_scl.external_connection
add_interface temp_sda conduit end
set_interface_property temp_sda EXPORT_OF temp_sda.external_connection
add_interface timer_1ms_external_port conduit end
set_interface_property timer_1ms_external_port EXPORT_OF timer_1ms.external_port
add_interface timer_1us_external_port conduit end
set_interface_property timer_1us_external_port EXPORT_OF timer_1us.external_port
add_interface tristate_conduit conduit end
set_interface_property tristate_conduit EXPORT_OF tristate_conduit_bridge_0.out

set_interconnect_requirement {$system} qsys_mm.clockCrossingAdapter HANDSHAKE
set_interconnect_requirement {$system} qsys_mm.insertDefaultSlave FALSE
set_interconnect_requirement {$system} qsys_mm.maxAdditionalLatency 1

save_system {MebX_Qsys_Project - Copia.qsys}
